# Altium project PROC054D_MMW_CAS_RF_EVM.PrjPcb (part 7 of 9)

## Sheet PROC054D_AWR_1_AWR_4_LC_Filtering.SchDoc: AWR_1_AWR_4_LC_Filtering
size 558 x 431 mm; Date: Not shown in title block; ApprovedBy: Not shown in title block; CheckedBy: Not shown in title block; Author: Not shown in title block; CompanyName: Not shown in title block; DrawnBy: a0271760; Engineer: Not shown in title block; Organization: Not shown in title block; Address1: Not shown in title block; Address2: Not shown in title block; Address3: Not shown in title block; Address4: Not shown in title block; DocumentNumber: 6; Revision: Use project pAWRameter SCH_Rev; SheetNumber: 6; SheetTotal: 19; PageSetup: Record=PageOptions|CenterHorizontal=True|CenterVertical=True|PrintScale=1.00|XCorrection=1.00|YCorrection=1.00|PrintKind=0|BorderSize=5000000|LeftOffset=0|BottomOffset=0|Orientation=2|PaperLength=1000|PaperWidth=1000|Scale=100|PaperSource=15|PrintQuality=600|MediaType=1|DitherType=10|PaperKind=Letter|PrintScaleMode=1; CurrentTime: Not shown in title block; CurrentDate: Not shown in title block; Time: Not shown in title block; DocumentFullPathAndName: Not shown in title block; DocumentName: Not shown in title block; ModifiedDate: Not shown in title block; ImagePath: Not shown in title block
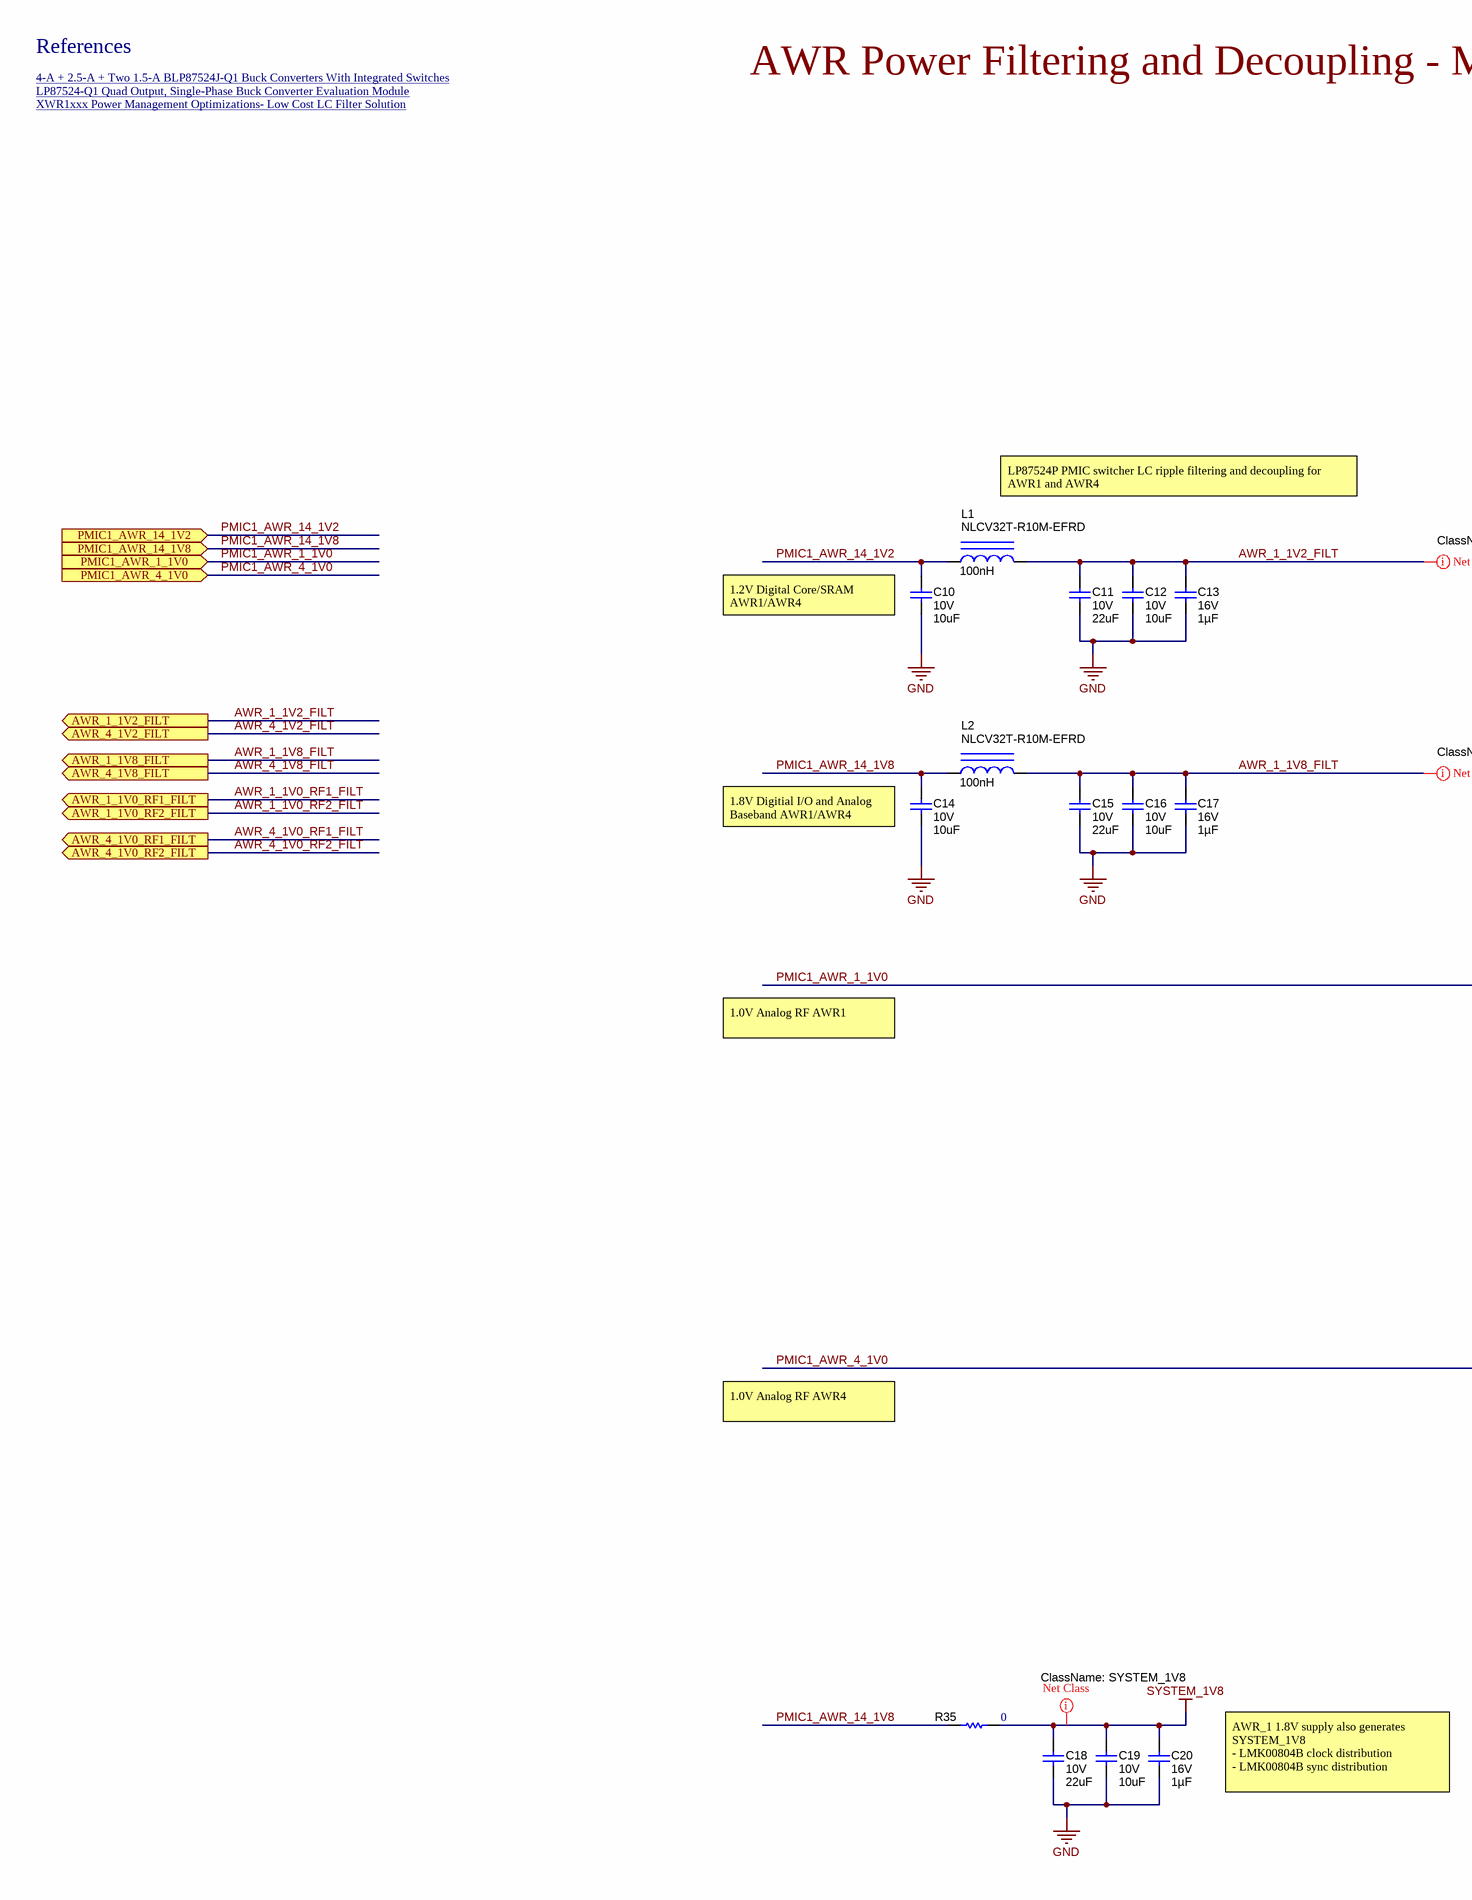
[diagram p32: PROC054D_AWR_1_AWR_4_LC_Filtering.SchDoc, left]
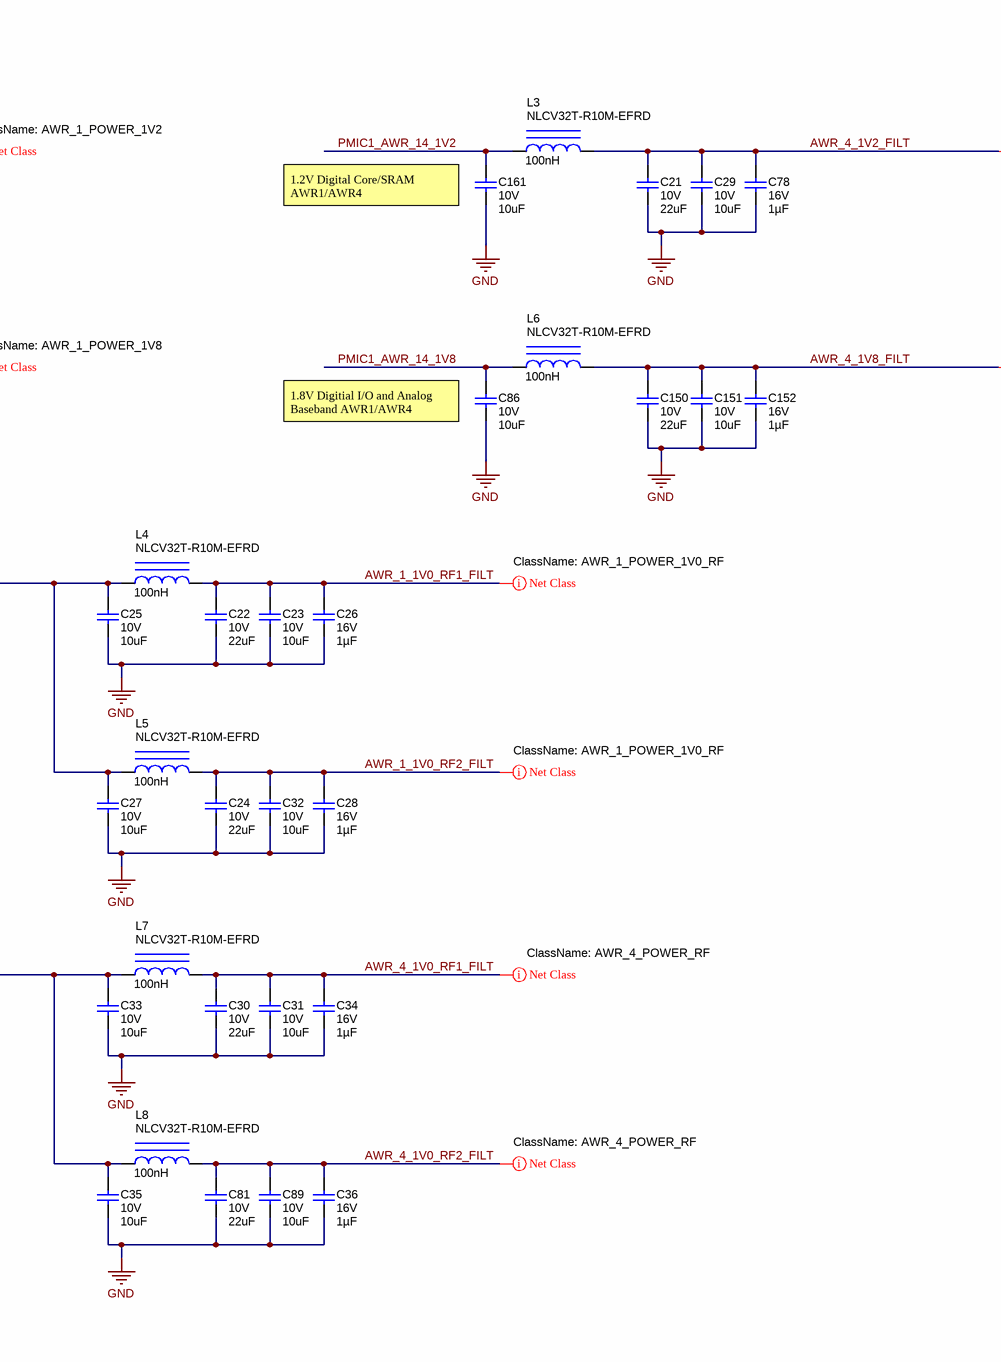
[diagram p33: PROC054D_AWR_1_AWR_4_LC_Filtering.SchDoc, right]

### Parts
C10  VDC_V: 10V  ValueDisplayed: 10uF  [0805L]  (hidden comment: GCM21BR71A106KE22L)
C11  VDC_V: 10V  ValueDisplayed: 22uF  [1206_180L]  (hidden comment: GCM31CR71A226KE02)
C12  VDC_V: 10V  ValueDisplayed: 10uF  [0805L]  (hidden comment: GCM21BR71A106KE22L)
C13  VDC_V: 16V  ValueDisplayed: 1µF  [0603S]  (hidden comment: GCM188R71C105KA64J)
C14  VDC_V: 10V  ValueDisplayed: 10uF  [0805L]  (hidden comment: GCM21BR71A106KE22L)
C15  VDC_V: 10V  ValueDisplayed: 22uF  [1206_180L]  (hidden comment: GCM31CR71A226KE02)
C16  VDC_V: 10V  ValueDisplayed: 10uF  [0805L]  (hidden comment: GCM21BR71A106KE22L)
C17  VDC_V: 16V  ValueDisplayed: 1µF  [0603S]  (hidden comment: GCM188R71C105KA64J)
C18  VDC_V: 10V  ValueDisplayed: 22uF  [1206_180L]  (hidden comment: GCM31CR71A226KE02)
C19  VDC_V: 10V  ValueDisplayed: 10uF  [0805L]  (hidden comment: GCM21BR71A106KE22L)
C20  VDC_V: 16V  ValueDisplayed: 1µF  [0603S]  (hidden comment: GCM188R71C105KA64J)
C21  VDC_V: 10V  ValueDisplayed: 22uF  [1206_180L]  (hidden comment: GCM31CR71A226KE02)
C22  VDC_V: 10V  ValueDisplayed: 22uF  [1206_180L]  (hidden comment: GCM31CR71A226KE02)
C23  VDC_V: 10V  ValueDisplayed: 10uF  [0805L]  (hidden comment: GCM21BR71A106KE22L)
C24  VDC_V: 10V  ValueDisplayed: 22uF  [1206_180L]  (hidden comment: GCM31CR71A226KE02)
C25  VDC_V: 10V  ValueDisplayed: 10uF  [0805L]  (hidden comment: GCM21BR71A106KE22L)
C26  VDC_V: 16V  ValueDisplayed: 1µF  [0603S]  (hidden comment: GCM188R71C105KA64J)
C27  VDC_V: 10V  ValueDisplayed: 10uF  [0805L]  (hidden comment: GCM21BR71A106KE22L)
C28  VDC_V: 16V  ValueDisplayed: 1µF  [0603S]  (hidden comment: GCM188R71C105KA64J)
C29  VDC_V: 10V  ValueDisplayed: 10uF  [0805L]  (hidden comment: GCM21BR71A106KE22L)
C30  VDC_V: 10V  ValueDisplayed: 22uF  [1206_180L]  (hidden comment: GCM31CR71A226KE02)
C31  VDC_V: 10V  ValueDisplayed: 10uF  [0805L]  (hidden comment: GCM21BR71A106KE22L)
C32  VDC_V: 10V  ValueDisplayed: 10uF  [0805L]  (hidden comment: GCM21BR71A106KE22L)
C33  VDC_V: 10V  ValueDisplayed: 10uF  [0805L]  (hidden comment: GCM21BR71A106KE22L)
C34  VDC_V: 16V  ValueDisplayed: 1µF  [0603S]  (hidden comment: GCM188R71C105KA64J)
C35  VDC_V: 10V  ValueDisplayed: 10uF  [0805L]  (hidden comment: GCM21BR71A106KE22L)
C36  VDC_V: 16V  ValueDisplayed: 1µF  [0603S]  (hidden comment: GCM188R71C105KA64J)
C78  VDC_V: 16V  ValueDisplayed: 1µF  [0603S]  (hidden comment: GCM188R71C105KA64J)
C81  VDC_V: 10V  ValueDisplayed: 22uF  [1206_180L]  (hidden comment: GCM31CR71A226KE02)
C86  VDC_V: 10V  ValueDisplayed: 10uF  [0805L]  (hidden comment: GCM21BR71A106KE22L)
C89  VDC_V: 10V  ValueDisplayed: 10uF  [0805L]  (hidden comment: GCM21BR71A106KE22L)
C150  VDC_V: 10V  ValueDisplayed: 22uF  [1206_180L]  (hidden comment: GCM31CR71A226KE02)
C151  VDC_V: 10V  ValueDisplayed: 10uF  [0805L]  (hidden comment: GCM21BR71A106KE22L)
C152  VDC_V: 16V  ValueDisplayed: 1µF  [0603S]  (hidden comment: GCM188R71C105KA64J)
C161  VDC_V: 10V  ValueDisplayed: 10uF  [0805L]  (hidden comment: GCM21BR71A106KE22L)
L1  ValueDisplayed: 100nH  [NLCV32]  (hidden comment: NLCV32T-R10M-EFRD)
L2  ValueDisplayed: 100nH  [NLCV32]  (hidden comment: NLCV32T-R10M-EFRD)
L3  ValueDisplayed: 100nH  [NLCV32]  (hidden comment: NLCV32T-R10M-EFRD)
L4  ValueDisplayed: 100nH  [NLCV32]  (hidden comment: NLCV32T-R10M-EFRD)
L5  ValueDisplayed: 100nH  [NLCV32]  (hidden comment: NLCV32T-R10M-EFRD)
L6  ValueDisplayed: 100nH  [NLCV32]  (hidden comment: NLCV32T-R10M-EFRD)
L7  ValueDisplayed: 100nH  [NLCV32]  (hidden comment: NLCV32T-R10M-EFRD)
L8  ValueDisplayed: 100nH  [NLCV32]  (hidden comment: NLCV32T-R10M-EFRD)
R35  ValueDisplayed: 0  [0805_HV]  (hidden comment: PMR10EZPJ000)

### Ports
AWR_1_1V0_RF1_FILT (out), AWR_1_1V0_RF2_FILT (out), AWR_1_1V2_FILT (out), AWR_1_1V8_FILT (out), AWR_4_1V0_RF1_FILT (out), AWR_4_1V0_RF2_FILT (out), AWR_4_1V2_FILT (out), AWR_4_1V8_FILT (out), PMIC1_AWR_1_1V0 (in), PMIC1_AWR_4_1V0 (in), PMIC1_AWR_14_1V2 (in), PMIC1_AWR_14_1V8 (in)

### Nets
GND: C10.2 C11.2 C12.2 C13.2 C14.2 C15.2 C16.2 C17.2 C18.2 C19.2 C20.2 C21.2 C22.2 C23.2 C24.2 C25.2 C26.2 C27.2 C28.2 C29.2 C30.2 C31.2 C32.2 C33.2 C34.2 C35.2 C36.2 C78.2 C81.2 C86.2 C89.2 C150.2 C151.2 C152.2 C161.2
SYSTEM_1V8: C18.1 C19.1 C20.1 R35.2
AWR_1_1V0_RF1_FILT: C22.1 C23.1 C26.1 L4.2 ; port AWR_1_1V0_RF1_FILT
AWR_1_1V0_RF2_FILT: C24.1 C28.1 C32.1 L5.2 ; port AWR_1_1V0_RF2_FILT
AWR_1_1V2_FILT: C11.1 C12.1 C13.1 L1.2 ; port AWR_1_1V2_FILT
AWR_1_1V8_FILT: C15.1 C16.1 C17.1 L2.2 ; port AWR_1_1V8_FILT
AWR_4_1V0_RF1_FILT: C30.1 C31.1 C34.1 L7.2 ; port AWR_4_1V0_RF1_FILT
AWR_4_1V0_RF2_FILT: C36.1 C81.1 C89.1 L8.2 ; port AWR_4_1V0_RF2_FILT
AWR_4_1V2_FILT: C21.1 C29.1 C78.1 L3.2 ; port AWR_4_1V2_FILT
AWR_4_1V8_FILT: C150.1 C151.1 C152.1 L6.2 ; port AWR_4_1V8_FILT
PMIC1_AWR_1_1V0: C25.1 C27.1 L4.1 L5.1 ; port PMIC1_AWR_1_1V0
PMIC1_AWR_4_1V0: C33.1 C35.1 L7.1 L8.1 ; port PMIC1_AWR_4_1V0
PMIC1_AWR_14_1V2: C10.1 C161.1 L1.1 L3.1 ; port PMIC1_AWR_14_1V2
PMIC1_AWR_14_1V8: C14.1 C86.1 L2.1 L6.1 R35.1 ; port PMIC1_AWR_14_1V8

### Layout directives
net class AWR_1_POWER_1V2: AWR_1_1V2_FILT
net class AWR_1_POWER_1V0_RF: AWR_1_1V0_RF1_FILT, AWR_1_1V0_RF2_FILT
net class AWR_4_POWER_RF: AWR_4_1V0_RF1_FILT, AWR_4_1V0_RF2_FILT
net class SYSTEM_1V8: SYSTEM_1V8
net class AWR_1_POWER_1V8: AWR_1_1V8_FILT
net class AWR_4_POWER_1V2: AWR_4_1V2_FILT
net class AWR_4_POWER_1V8: AWR_4_1V8_FILT

### Notes on the sheet
- References
- LP87524-Q1 Quad Output, Single-Phase Buck Converter Evaluation Module <http://www.ti.com/tool/lp87524q1evm>
- XWR1xxx Power Management Optimizations- Low Cost LC Filter Solution <http://www.ti.com/lit/pdf/swra577>
- 4-A + 2.5-A + Two 1.5-A BLP87524J-Q1 Buck Converters With Integrated Switches <http://www.ti.com/product/lp87524j-q1>
- AWR Power Filtering and Decoupling - Master AWR_1 and Slave AWR_4
- LP87524P PMIC switcher LC ripple filtering and decoupling for AWR1 and AWR4
- (near C10) 1.2V Digital Core/SRAM AWR1/AWR4
- (near C161) 1.2V Digital Core/SRAM AWR1/AWR4
- (near C14) 1.8V Digitial I/O and Analog Baseband AWR1/AWR4
- (near C86) 1.8V Digitial I/O and Analog Baseband AWR1/AWR4
- 1.0V Analog RF AWR1
- 1.0V Analog RF AWR4
- AWR_1 1.8V supply also generates SYSTEM_1V8
  - LMK00804B clock distribution
  - LMK00804B sync distribution
- Drawn By:
- SVN Rev:
- Number:
- TID #:
- Orderable:
- Rev:
- Sheet Title:
- File:
- Project Title:
- Designed for:
- Assembly VAWRiant:
- Mod. Date:
- Sheet:
- Size:
- of
- C
- http://www.ti.com
- Texas Instruments and/or its licensors do not wAWRrant the accuracy or completeness of this specification or any information contained therein. Texas Instruments and/or its licensors do not wAWRrant that this design will meet the specifications, will be suitable for your application or fit for any pAWRticulAWR purpose, or will operate in an implementation. Texas Instruments and/or its licensors do not wAWRrant that the design is production worthy. You should completely validate and test your design implementation to confirm the system functionality for your application.
- Engineer:
- Contact:
- © Texas Instruments

### Library data of the parts
C10 C12 C14 C16 C23 C25 C27 C29 C31-C33 C35 C86 C89 C151 C161 = CMP-0008017-2: CAP, CERM, 10 uF, 10 V, +/- 10%, X7R, 0805; Manufacturer: MuRata; TaMin_C: -55°C; Polarized: N; SizeAreaWB_mm2: 6.75; Value1: Unknown; U/M: EA; Value: 10uF; TaMax_C: 125°C; SizeZ_mm: 1.45; SizeX_mm: 2; SizeY_mm: 1.25; Cap_Case: 0805; SizeArea_mm2: 2.5; Cap_F: 10µF; AEC Category: Q200; Supplier Part Number 2: 06AC6014; Publisher: Texas Instruments; Supplier 2: Newark; Supplier Part Number 3: 81-GCM21BR71A106KE2L; TempCo: X7R; Supplier 3: Mouser; Published: 2008-06-19; RoHS: Y; MountType: SMT; Supplier 1: Digi-Key; PackageReference: 0805; Tolerance_%: 10%; Value2: 10V; CompType: Capacitor; LatestRevisionDate: 2017-03-09; PartNumber: GCM21BR71A106KE22L; AEC Qualified: ?; ComponentLink1Description: Datasheet link; Supplier Part Number 1: 490-10674-1-ND; Technology: Ceramic; ComponentLink1URL: http://www.murata.com/products/catalog/pdf/c03e.pdf
C11 C18 = CMP-0008811-2: CAP, CERM, 22 uF, 10 V, +/- 10%, X7R, AEC-Q200 Grade 1, 1206; Manufacturer: MuRata; TaMin_C: -55°C; Polarized: N; SizeAreaWB_mm2: 10.92; Value1: Unknown; U/M: EA; Value: 22uF; TaMax_C: 125°C; SizeZ_mm: 1.8; SizeX_mm: 3.2; SizeY_mm: 1.6; Cap_Case: 1206; SizeArea_mm2: 5.12; CompType: Capacitor; AEC Qualified: Y; Cap_F: 22µF; AEC Grade: 1; AEC Category: Q200; Publisher: Texas Instruments; TempCo: X7R; Published: 2008-06-19; RoHS: Y; MountType: SMT; PackageReference: 1206; Tolerance_%: 10%; Value2: 10V; LatestRevisionDate: 2017-03-09; PartNumber: GCM31CR71A226KE02; ComponentLink1Description: Datasheet link; Technology: Ceramic; ComponentLink1URL: http://psearch.en.murata.com/capacitor/product/GCM31CR71A226KE02%23.pdf
C13 C17 C26 C28 C34 C36 C78 C152 = CMP-0079154-1: CAP, CERM, 1 µF, 16 V,+/- 10%, X7R, AEC-Q200 Grade 1, 0603; Manufacturer: MuRata; SizeAreaWB_mm2: 4.68; SizeArea_mm2: 1.28; AEC Qualified: Y; AEC Category: Q200; Value: 1uF; TaMax_C: 125°C; SizeZ_mm: 1; Polarized: N; TaMin_C: -55°C; SizeY_mm: 0.8; U/M: EA; SizeX_mm: 1.6; Cap_Case: 0603; ComponentLink1Description: Datasheet link; Cap_F: 1µF; RoHS: Y; Tolerance_%: 10%; Supplier 1: Digi-Key; PackageReference: 0603; Technology: Ceramic; PartNumber: GCM188R71C105KA64J; TempCo: X7R; Supplier Part Number 2: 81-GCM188R71C105KA4J; Supplier 2: Mouser; AEC Grade: 1; Value2: 16V; ComponentLink1URL: https://www.murata.com/~/media/webrenewal/support/library/catalog/products/capacitor/mlcc/c03e.ashx; CompType: Capacitor; MountType: SMT; Supplier Part Number 1: 490-12657-1-ND
C15 C21 C22 C24 C30 C81 C150 = CMP-0008811-2: CAP, CERM, 22 uF, 10 V, +/- 10%, X7R, AEC-Q200 Grade 1, 1206; Manufacturer: MuRata; TaMin_C: -55°C; Polarized: N; SizeAreaWB_mm2: 10.92; Value1: Unknown; U/M: EA; Value: 22uF; TaMax_C: 125°C; SizeZ_mm: 1.8; SizeX_mm: 3.2; SizeY_mm: 1.6; Cap_Case: 1206; SizeArea_mm2: 5.12; AEC Qualified: Y; Cap_F: 22µF; AEC Grade: 1; AEC Category: Q200; Publisher: Texas Instruments; TempCo: X7R; Published: 2008-06-19; RoHS: Y; MountType: SMT; PackageReference: 1206; Tolerance_%: 10%; Value2: 10V; CompType: Capacitor; LatestRevisionDate: 2017-03-09; PartNumber: GCM31CR71A226KE02; ComponentLink1Description: Datasheet link; Technology: Ceramic; ComponentLink1URL: http://psearch.en.murata.com/capacitor/product/GCM31CR71A226KE02%23.pdf
C19 = CMP-0008017-2: CAP, CERM, 10 uF, 10 V, +/- 10%, X7R, 0805; Manufacturer: MuRata; TaMin_C: -55°C; Polarized: N; SizeAreaWB_mm2: 6.75; Value1: Unknown; U/M: EA; Value: 10uF; TaMax_C: 125°C; SizeZ_mm: 1.45; SizeX_mm: 2; SizeY_mm: 1.25; Cap_Case: 0805; SizeArea_mm2: 2.5; CompType: Capacitor; Cap_F: 10µF; AEC Category: Q200; Supplier Part Number 2: 06AC6014; Publisher: Texas Instruments; Supplier 2: Newark; Supplier Part Number 3: 81-GCM21BR71A106KE2L; TempCo: X7R; Supplier 3: Mouser; Published: 2008-06-19; RoHS: Y; MountType: SMT; Supplier 1: Digi-Key; PackageReference: 0805; Tolerance_%: 10%; Value2: 10V; LatestRevisionDate: 2017-03-09; PartNumber: GCM21BR71A106KE22L; AEC Qualified: ?; ComponentLink1Description: Datasheet link; Supplier Part Number 1: 490-10674-1-ND; Technology: Ceramic; ComponentLink1URL: http://www.murata.com/products/catalog/pdf/c03e.pdf
C20 = CMP-0079154-1: CAP, CERM, 1 µF, 16 V,+/- 10%, X7R, AEC-Q200 Grade 1, 0603; Manufacturer: MuRata; SizeAreaWB_mm2: 4.68; SizeArea_mm2: 1.28; AEC Qualified: Y; AEC Category: Q200; Value: 1uF; TaMax_C: 125°C; SizeZ_mm: 1; Polarized: N; TaMin_C: -55°C; SizeY_mm: 0.8; U/M: EA; CompType: Capacitor; SizeX_mm: 1.6; Cap_Case: 0603; ComponentLink1Description: Datasheet link; Cap_F: 1µF; RoHS: Y; Tolerance_%: 10%; Supplier 1: Digi-Key; PackageReference: 0603; Technology: Ceramic; PartNumber: GCM188R71C105KA64J; TempCo: X7R; Supplier Part Number 2: 81-GCM188R71C105KA4J; Supplier 2: Mouser; AEC Grade: 1; Value2: 16V; ComponentLink1URL: https://www.murata.com/~/media/webrenewal/support/library/catalog/products/capacitor/mlcc/c03e.ashx; MountType: SMT; Supplier Part Number 1: 490-12657-1-ND
L1-L8 = CMP-0083745-1: Inductor, Wirewound, Ferrite, 100 nH, 2.85 A, 0.024 ohm, AEC-Q200 Grade 1, SMD; Manufacturer: TDK; Isat: 2.85A @ 10% inductance drop; Irms: 2.85A @ 40C rise; SizeAreaWB_mm2: 13.44; DCR_ohm: 0.024; Value: 100nH; Imax_A: 2.85A; SizeZ_mm: 2.5; SizeX_mm: 3.2; SizeY_mm: 2.2; SizeArea_mm2: 7.04; AEC Qualified: Y; AEC Grade: 1; AEC Category: Q200; ComponentLink1URL: https://product.tdk.com/info/en/catalog/datasheets/inductor_automotive_decoupling_nlcv32-efrd_en.pdf; RoHS: Y; Value1: 0.024 ohm; Material: Ferrite; MountType: SMT; PackageReference: 3.2x2.2x2.5mm; Value2: 2.85A; CompType: Inductor; Ind_H: 100nH; PartNumber: NLCV32T-R10M-EFRD; ComponentLink1Description: Datasheet link; Technology: Wirewound
R35 = CMP-0081857-1: RES, 0, 0%,  W, AEC-Q200 Grade 0, 0805; Manufacturer: Rohm; SizeAreaWB_mm2: 6.75; SizeArea_mm2: 2.5; AEC Qualified: Y; AEC Category: Q200; Value: 0; SizeZ_mm: 1.45; SizeY_mm: 1.25; SizeX_mm: 2; ComponentLink1Description: Datasheet link; RoHS: Y; Tolerance_%: 0%; Value_Code: 0; Supplier 1: Mouser; PackageReference: 0805; Technology: Thick Film; Res_ohm: 0; PartNumber: PMR10EZPJ000; AEC Grade: 0; Value2: W; ComponentLink1URL: http://www.rohm.com/web/global/datasheet/PMR10EZPJ000/pmr-jpw-e; Value1: 0%; CompType: Resistor; MountType: SMT; Supplier Part Number 1: 755-PMR10EZPJ000

## Sheet PROC054D_AWR_2_AWR_3_LC_Filtering.SchDoc: AWR_2_AWR_3_LC_Filtering
size 558 x 431 mm; Date: Not shown in title block; ApprovedBy: Not shown in title block; CheckedBy: Not shown in title block; Author: Not shown in title block; CompanyName: Not shown in title block; DrawnBy: a0271760; Engineer: Not shown in title block; Organization: Not shown in title block; Address1: Not shown in title block; Address2: Not shown in title block; Address3: Not shown in title block; Address4: Not shown in title block; DocumentNumber: 7; Revision: Use project pAWRameter SCH_Rev; SheetNumber: 7; SheetTotal: 19; PageSetup: Record=PageOptions|CenterHorizontal=True|CenterVertical=True|PrintScale=1.00|XCorrection=1.00|YCorrection=1.00|PrintKind=0|BorderSize=5000000|LeftOffset=0|BottomOffset=0|Orientation=2|PaperLength=1000|PaperWidth=1000|Scale=100|PaperSource=15|PrintQuality=600|MediaType=1|DitherType=10|PaperKind=Letter|PrintScaleMode=1; CurrentTime: Not shown in title block; CurrentDate: Not shown in title block; Time: Not shown in title block; DocumentFullPathAndName: Not shown in title block; DocumentName: Not shown in title block; ModifiedDate: Not shown in title block; ImagePath: Not shown in title block
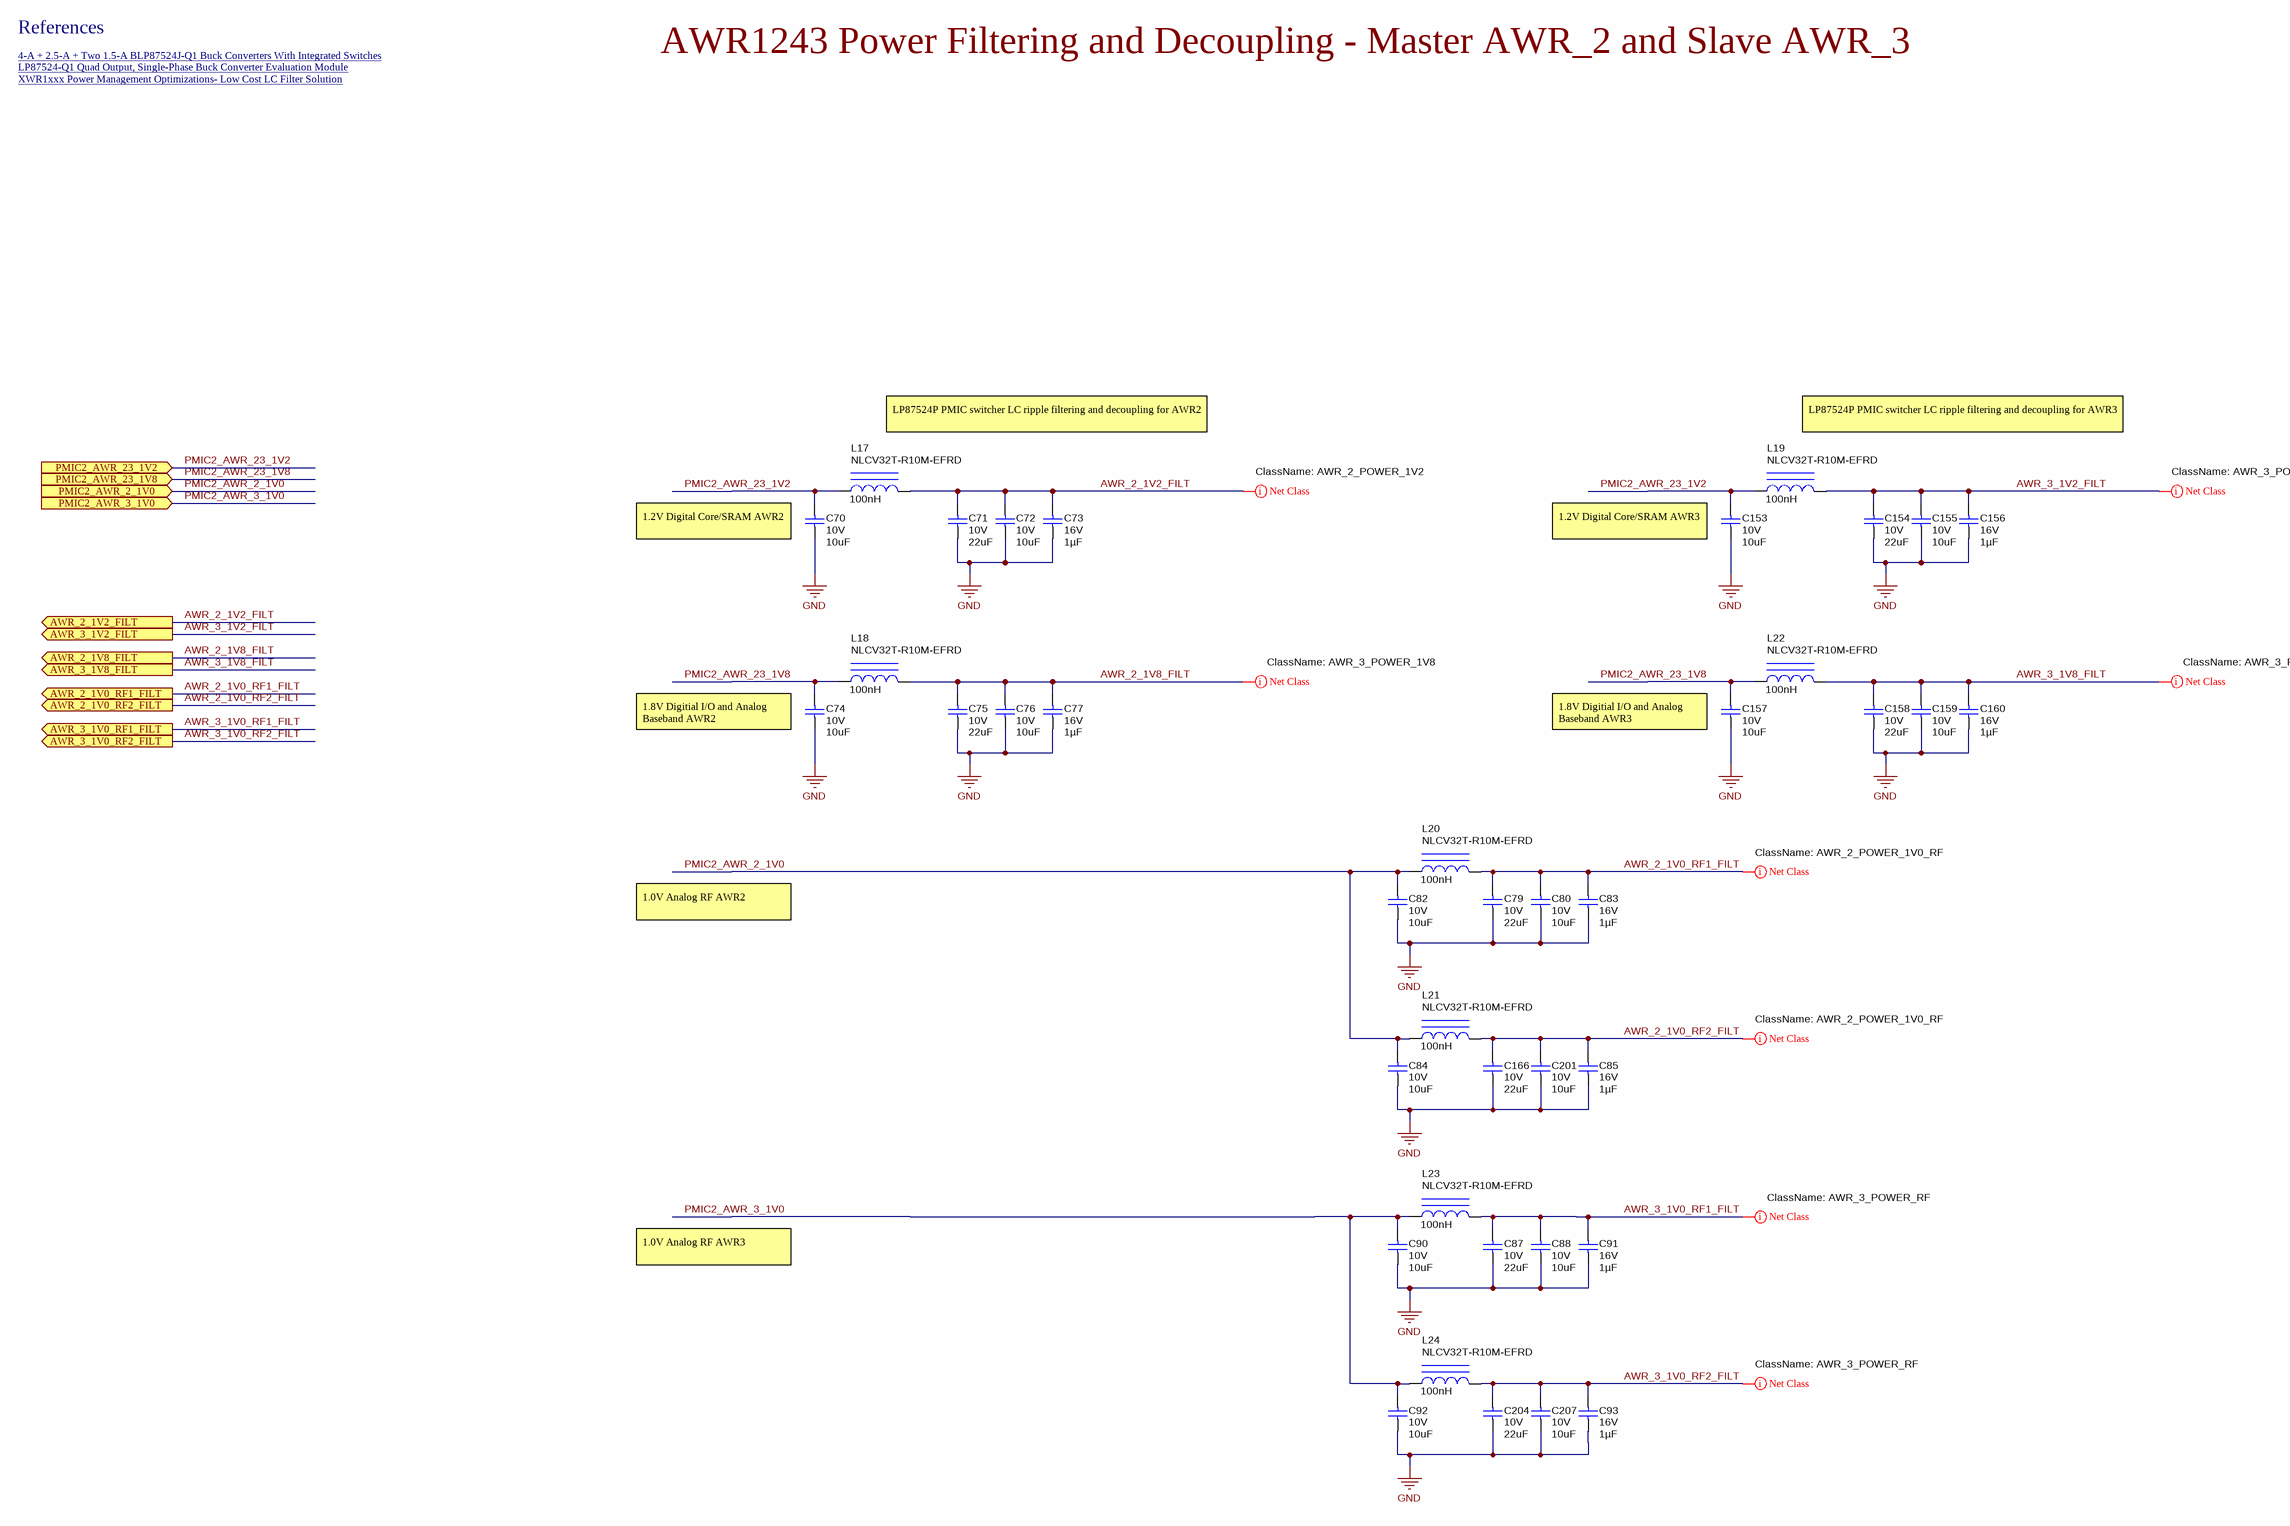
[diagram p34: PROC054D_AWR_2_AWR_3_LC_Filtering.SchDoc]

### Parts
C70  VDC_V: 10V  ValueDisplayed: 10uF  [0805L]  (hidden comment: GCM21BR71A106KE22L)
C71  VDC_V: 10V  ValueDisplayed: 22uF  [1206_180L]  (hidden comment: GCM31CR71A226KE02)
C72  VDC_V: 10V  ValueDisplayed: 10uF  [0805L]  (hidden comment: GCM21BR71A106KE22L)
C73  VDC_V: 16V  ValueDisplayed: 1µF  [0603S]  (hidden comment: GCM188R71C105KA64J)
C74  VDC_V: 10V  ValueDisplayed: 10uF  [0805L]  (hidden comment: GCM21BR71A106KE22L)
C75  VDC_V: 10V  ValueDisplayed: 22uF  [1206_180L]  (hidden comment: GCM31CR71A226KE02)
C76  VDC_V: 10V  ValueDisplayed: 10uF  [0805L]  (hidden comment: GCM21BR71A106KE22L)
C77  VDC_V: 16V  ValueDisplayed: 1µF  [0603S]  (hidden comment: GCM188R71C105KA64J)
C79  VDC_V: 10V  ValueDisplayed: 22uF  [1206_180L]  (hidden comment: GCM31CR71A226KE02)
C80  VDC_V: 10V  ValueDisplayed: 10uF  [0805L]  (hidden comment: GCM21BR71A106KE22L)
C82  VDC_V: 10V  ValueDisplayed: 10uF  [0805L]  (hidden comment: GCM21BR71A106KE22L)
C83  VDC_V: 16V  ValueDisplayed: 1µF  [0603S]  (hidden comment: GCM188R71C105KA64J)
C84  VDC_V: 10V  ValueDisplayed: 10uF  [0805L]  (hidden comment: GCM21BR71A106KE22L)
C85  VDC_V: 16V  ValueDisplayed: 1µF  [0603S]  (hidden comment: GCM188R71C105KA64J)
C87  VDC_V: 10V  ValueDisplayed: 22uF  [1206_180L]  (hidden comment: GCM31CR71A226KE02)
C88  VDC_V: 10V  ValueDisplayed: 10uF  [0805L]  (hidden comment: GCM21BR71A106KE22L)
C90  VDC_V: 10V  ValueDisplayed: 10uF  [0805L]  (hidden comment: GCM21BR71A106KE22L)
C91  VDC_V: 16V  ValueDisplayed: 1µF  [0603S]  (hidden comment: GCM188R71C105KA64J)
C92  VDC_V: 10V  ValueDisplayed: 10uF  [0805L]  (hidden comment: GCM21BR71A106KE22L)
C93  VDC_V: 16V  ValueDisplayed: 1µF  [0603S]  (hidden comment: GCM188R71C105KA64J)
C153  VDC_V: 10V  ValueDisplayed: 10uF  [0805L]  (hidden comment: GCM21BR71A106KE22L)
C154  VDC_V: 10V  ValueDisplayed: 22uF  [1206_180L]  (hidden comment: GCM31CR71A226KE02)
C155  VDC_V: 10V  ValueDisplayed: 10uF  [0805L]  (hidden comment: GCM21BR71A106KE22L)
C156  VDC_V: 16V  ValueDisplayed: 1µF  [0603S]  (hidden comment: GCM188R71C105KA64J)
C157  VDC_V: 10V  ValueDisplayed: 10uF  [0805L]  (hidden comment: GCM21BR71A106KE22L)
C158  VDC_V: 10V  ValueDisplayed: 22uF  [1206_180L]  (hidden comment: GCM31CR71A226KE02)
C159  VDC_V: 10V  ValueDisplayed: 10uF  [0805L]  (hidden comment: GCM21BR71A106KE22L)
C160  VDC_V: 16V  ValueDisplayed: 1µF  [0603S]  (hidden comment: GCM188R71C105KA64J)
C166  VDC_V: 10V  ValueDisplayed: 22uF  [1206_180L]  (hidden comment: GCM31CR71A226KE02)
C201  VDC_V: 10V  ValueDisplayed: 10uF  [0805L]  (hidden comment: GCM21BR71A106KE22L)
C204  VDC_V: 10V  ValueDisplayed: 22uF  [1206_180L]  (hidden comment: GCM31CR71A226KE02)
C207  VDC_V: 10V  ValueDisplayed: 10uF  [0805L]  (hidden comment: GCM21BR71A106KE22L)
L17  ValueDisplayed: 100nH  [NLCV32]  (hidden comment: NLCV32T-R10M-EFRD)
L18  ValueDisplayed: 100nH  [NLCV32]  (hidden comment: NLCV32T-R10M-EFRD)
L19  ValueDisplayed: 100nH  [NLCV32]  (hidden comment: NLCV32T-R10M-EFRD)
L20  ValueDisplayed: 100nH  [NLCV32]  (hidden comment: NLCV32T-R10M-EFRD)
L21  ValueDisplayed: 100nH  [NLCV32]  (hidden comment: NLCV32T-R10M-EFRD)
L22  ValueDisplayed: 100nH  [NLCV32]  (hidden comment: NLCV32T-R10M-EFRD)
L23  ValueDisplayed: 100nH  [NLCV32]  (hidden comment: NLCV32T-R10M-EFRD)
L24  ValueDisplayed: 100nH  [NLCV32]  (hidden comment: NLCV32T-R10M-EFRD)

### Ports
AWR_2_1V0_RF1_FILT (out), AWR_2_1V0_RF2_FILT (out), AWR_2_1V2_FILT (out), AWR_2_1V8_FILT (out), AWR_3_1V0_RF1_FILT (out), AWR_3_1V0_RF2_FILT (out), AWR_3_1V2_FILT (out), AWR_3_1V8_FILT (out), PMIC2_AWR_2_1V0 (in), PMIC2_AWR_3_1V0 (in), PMIC2_AWR_23_1V2 (in), PMIC2_AWR_23_1V8 (in)

### Nets
GND: C70.2 C71.2 C72.2 C73.2 C74.2 C75.2 C76.2 C77.2 C79.2 C80.2 C82.2 C83.2 C84.2 C85.2 C87.2 C88.2 C90.2 C91.2 C92.2 C93.2 C153.2 C154.2 C155.2 C156.2 C157.2 C158.2 C159.2 C160.2 C166.2 C201.2 C204.2 C207.2
AWR_2_1V0_RF1_FILT: C79.1 C80.1 C83.1 L20.2 ; port AWR_2_1V0_RF1_FILT
AWR_2_1V0_RF2_FILT: C85.1 C166.1 C201.1 L21.2 ; port AWR_2_1V0_RF2_FILT
AWR_2_1V2_FILT: C71.1 C72.1 C73.1 L17.2 ; port AWR_2_1V2_FILT
AWR_2_1V8_FILT: C75.1 C76.1 C77.1 L18.2 ; port AWR_2_1V8_FILT
AWR_3_1V0_RF1_FILT: C87.1 C88.1 C91.1 L23.2 ; port AWR_3_1V0_RF1_FILT
AWR_3_1V0_RF2_FILT: C93.1 C204.1 C207.1 L24.2 ; port AWR_3_1V0_RF2_FILT
AWR_3_1V2_FILT: C154.1 C155.1 C156.1 L19.2 ; port AWR_3_1V2_FILT
AWR_3_1V8_FILT: C158.1 C159.1 C160.1 L22.2 ; port AWR_3_1V8_FILT
PMIC2_AWR_2_1V0: C82.1 C84.1 L20.1 L21.1 ; port PMIC2_AWR_2_1V0
PMIC2_AWR_3_1V0: C90.1 C92.1 L23.1 L24.1 ; port PMIC2_AWR_3_1V0
PMIC2_AWR_23_1V2: C70.1 C153.1 L17.1 L19.1 ; port PMIC2_AWR_23_1V2
PMIC2_AWR_23_1V8: C74.1 C157.1 L18.1 L22.1 ; port PMIC2_AWR_23_1V8

### Layout directives
net class AWR_2_POWER_1V2: AWR_2_1V2_FILT
net class AWR_2_POWER_1V0_RF: AWR_2_1V0_RF1_FILT, AWR_2_1V0_RF2_FILT
net class AWR_3_POWER_RF: AWR_3_1V0_RF1_FILT, AWR_3_1V0_RF2_FILT
net class AWR_3_POWER_1V8: AWR_2_1V8_FILT, AWR_3_1V8_FILT
net class AWR_3_POWER_1V2: AWR_3_1V2_FILT

### Notes on the sheet
- References
- 4-A + 2.5-A + Two 1.5-A BLP87524J-Q1 Buck Converters With Integrated Switches <http://www.ti.com/product/lp87524j-q1>
- LP87524-Q1 Quad Output, Single-Phase Buck Converter Evaluation Module <http://www.ti.com/tool/lp87524q1evm>
- XWR1xxx Power Management Optimizations- Low Cost LC Filter Solution <http://www.ti.com/lit/pdf/swra577>
- AWR1243 Power Filtering and Decoupling - Master AWR_2 and Slave AWR_3
- LP87524P PMIC switcher LC ripple filtering and decoupling for AWR2
- LP87524P PMIC switcher LC ripple filtering and decoupling for AWR3
- (near C70) 1.2V Digital Core/SRAM AWR2
- (near C153) 1.2V Digital Core/SRAM AWR3
- (near C74) 1.8V Digitial I/O and Analog Baseband AWR2
- (near C157) 1.8V Digitial I/O and Analog Baseband AWR3
- 1.0V Analog RF AWR2
- 1.0V Analog RF AWR3
- Drawn By:
- SVN Rev:
- Number:
- TID #:
- Orderable:
- Rev:
- Sheet Title:
- File:
- Project Title:
- Designed for:
- Assembly VAWRiant:
- Mod. Date:
- Sheet:
- Size:
- of
- C
- http://www.ti.com
- Texas Instruments and/or its licensors do not wAWRrant the accuracy or completeness of this specification or any information contained therein. Texas Instruments and/or its licensors do not wAWRrant that this design will meet the specifications, will be suitable for your application or fit for any pAWRticulAWR purpose, or will operate in an implementation. Texas Instruments and/or its licensors do not wAWRrant that the design is production worthy. You should completely validate and test your design implementation to confirm the system functionality for your application.
- Engineer:
- Contact:
- © Texas Instruments

### Library data of the parts
C70 C72 C74 C76 C80 C82 C84 C88 C90 C92 C153 C155 C157 C159 C201 C207 = CMP-0008017-2: as C10 on sheet PROC054D_AWR_1_AWR_4_LC_Filtering; Supplier Part Number 2: 06AC6014; Publisher: Texas Instruments; Supplier 2: Newark; Supplier Part Number 3: 81-GCM21BR71A106KE2L; TempCo: X7R; Supplier 3: Mouser; Published: 2008-06-19; RoHS: Y; MountType: SMT; Supplier 1: Digi-Key; PackageReference: 0805; Tolerance_%: 10%; Value2: 10V; CompType: Capacitor; LatestRevisionDate: 2017-03-09; PartNumber: GCM21BR71A106KE22L; AEC Qualified: ?; ComponentLink1Description: Datasheet link; Supplier Part Number 1: 490-10674-1-ND; Technology: Ceramic; ComponentLink1URL: http://www.murata.com/products/catalog/pdf/c03e.pdf
C71 C75 C79 C87 C154 C158 C166 C204 = CMP-0008811-2: as C15 on sheet PROC054D_AWR_1_AWR_4_LC_Filtering; Publisher: Texas Instruments; TempCo: X7R; Published: 2008-06-19; RoHS: Y; MountType: SMT; PackageReference: 1206; Tolerance_%: 10%; Value2: 10V; CompType: Capacitor; LatestRevisionDate: 2017-03-09; PartNumber: GCM31CR71A226KE02; ComponentLink1Description: Datasheet link; Technology: Ceramic; ComponentLink1URL: http://psearch.en.murata.com/capacitor/product/GCM31CR71A226KE02%23.pdf
C73 C77 C83 C85 C91 C93 C156 C160 = CMP-0079154-1: as C13 on sheet PROC054D_AWR_1_AWR_4_LC_Filtering; ComponentLink1Description: Datasheet link; Cap_F: 1µF; RoHS: Y; Tolerance_%: 10%; Supplier 1: Digi-Key; PackageReference: 0603; Technology: Ceramic; PartNumber: GCM188R71C105KA64J; TempCo: X7R; Supplier Part Number 2: 81-GCM188R71C105KA4J; Supplier 2: Mouser; AEC Grade: 1; Value2: 16V; ComponentLink1URL: https://www.murata.com/~/media/webrenewal/support/library/catalog/products/capacitor/mlcc/c03e.ashx; CompType: Capacitor; MountType: SMT; Supplier Part Number 1: 490-12657-1-ND
L17-L24 = CMP-0083745-1: as L1 on sheet PROC054D_AWR_1_AWR_4_LC_Filtering; ComponentLink1URL: https://product.tdk.com/info/en/catalog/datasheets/inductor_automotive_decoupling_nlcv32-efrd_en.pdf; RoHS: Y; Value1: 0.024 ohm; Material: Ferrite; MountType: SMT; PackageReference: 3.2x2.2x2.5mm; Value2: 2.85A; CompType: Inductor; Ind_H: 100nH; PartNumber: NLCV32T-R10M-EFRD; ComponentLink1Description: Datasheet link; Technology: Wirewound

## Sheet PROC054D_System_LED.SchDoc: SYSTEM_LED
size 558 x 431 mm; Date: Not shown in title block; ApprovedBy: Not shown in title block; CheckedBy: Not shown in title block; Author: Not shown in title block; CompanyName: Not shown in title block; DrawnBy: a0271760; Engineer: Not shown in title block; Organization: Not shown in title block; Address1: Not shown in title block; Address2: Not shown in title block; Address3: Not shown in title block; Address4: Not shown in title block; DocumentNumber: 17; Revision: Use project pAWRameter SCH_Rev; SheetNumber: 17; SheetTotal: 19; PageSetup: Record=PageOptions|CenterHorizontal=True|CenterVertical=True|PrintScale=1.00|XCorrection=1.00|YCorrection=1.00|PrintKind=0|BorderSize=5000000|LeftOffset=0|BottomOffset=0|Orientation=2|PaperLength=1000|PaperWidth=1000|Scale=100|PaperSource=15|PrintQuality=600|MediaType=1|DitherType=10|PaperKind=Letter|PrintScaleMode=1; CurrentTime: Not shown in title block; CurrentDate: Not shown in title block; Time: Not shown in title block; DocumentFullPathAndName: Not shown in title block; DocumentName: Not shown in title block; ModifiedDate: Not shown in title block; ImagePath: Not shown in title block
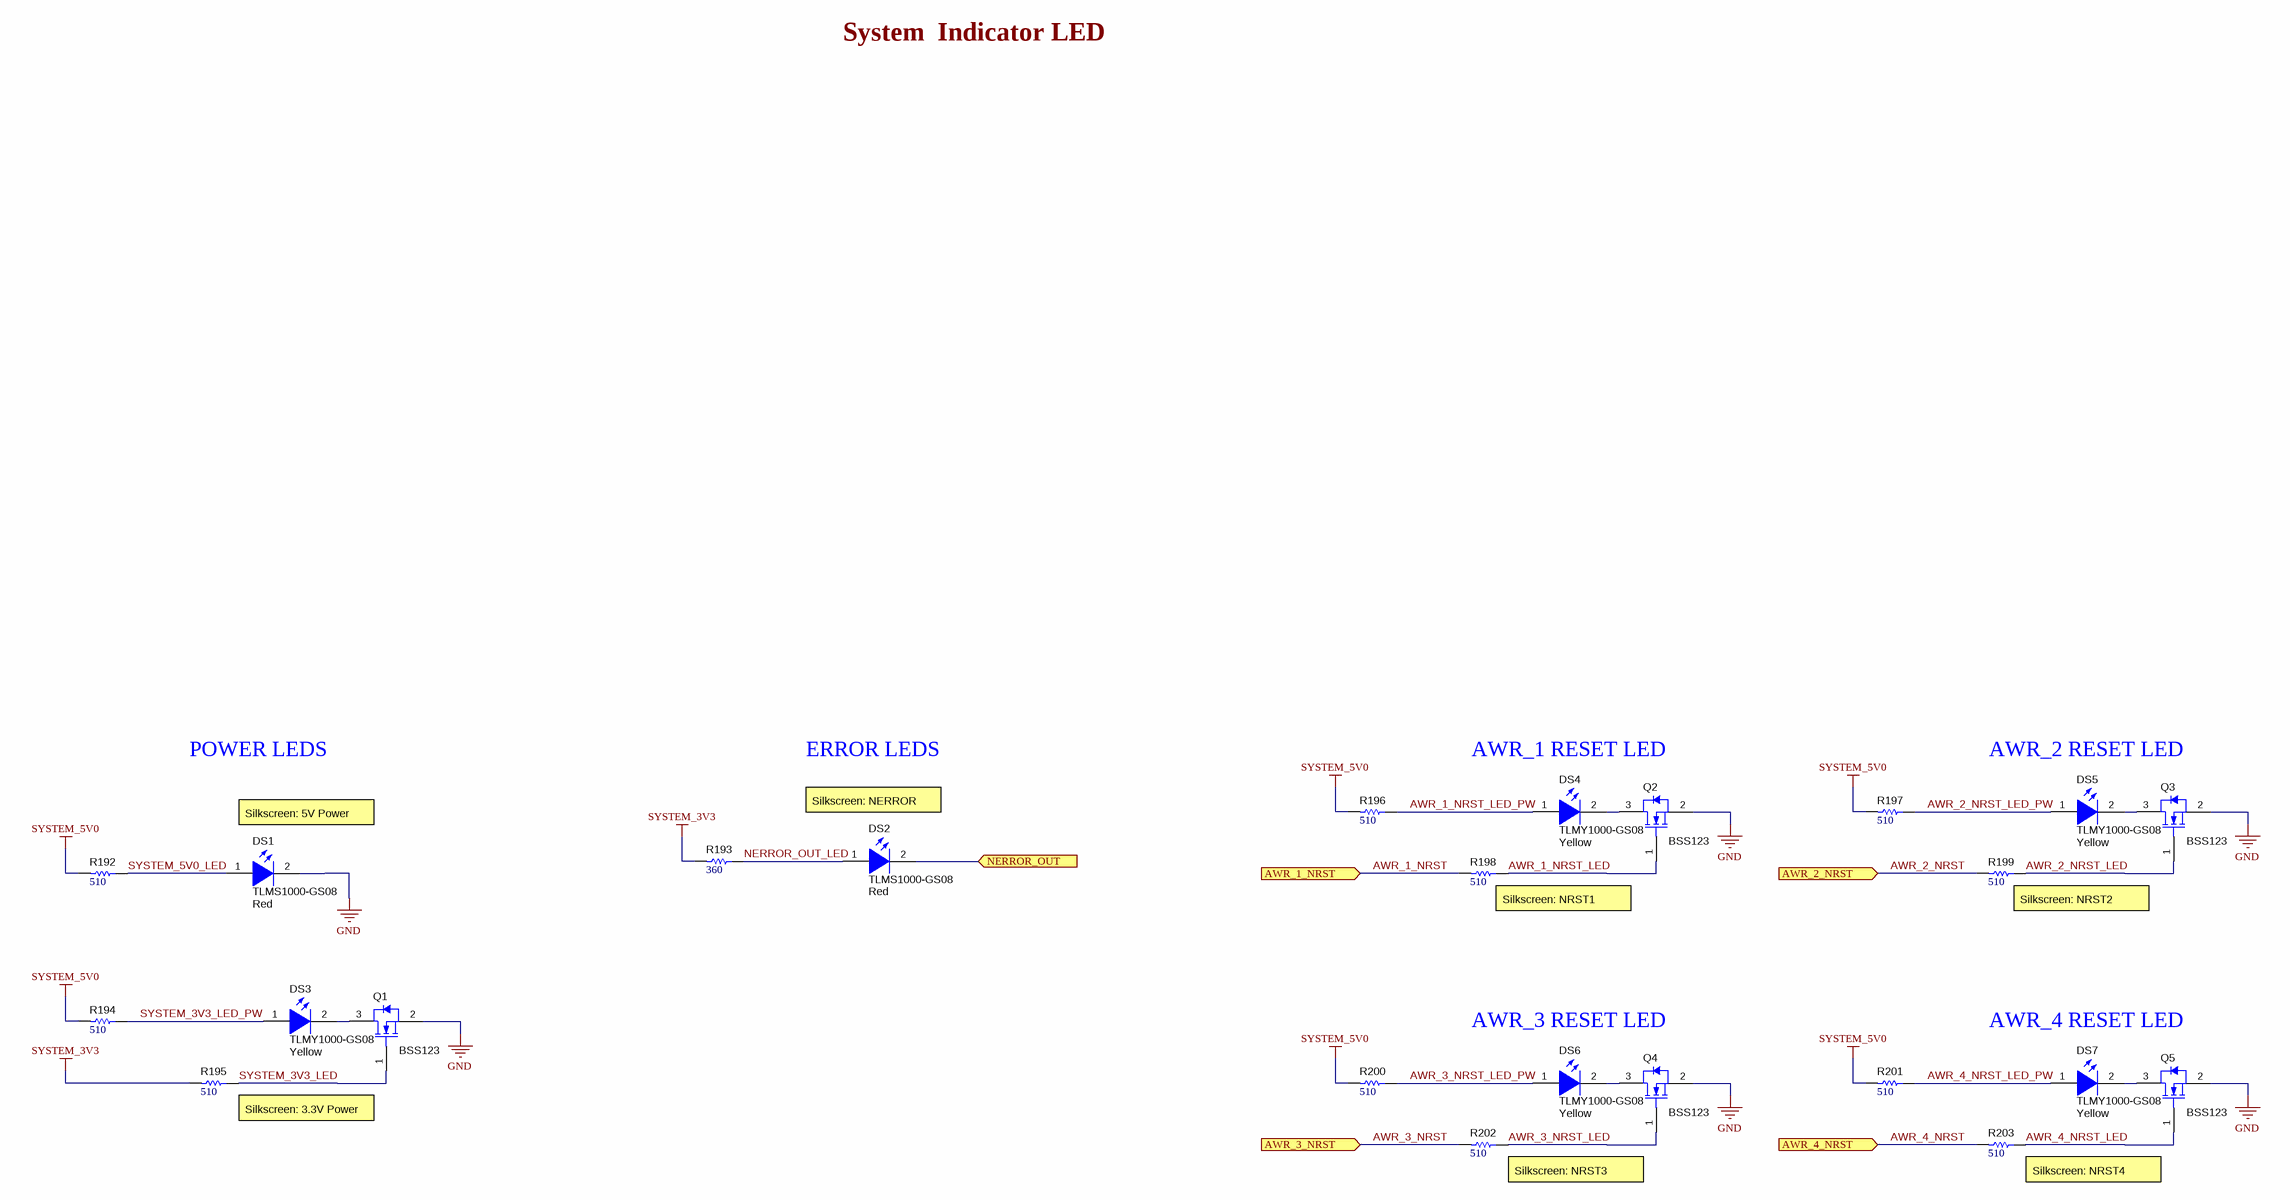
[diagram p35: PROC054D_System_LED.SchDoc]

### Parts
DS1  TLMS1000-GS08  value Red  [TLMx1000_Red]
DS2  TLMS1000-GS08  value Red  [TLMx1000_Red]
DS3  TLMY1000-GS08  value Yellow  [TLMx1000_Yellow]
DS4  TLMY1000-GS08  value Yellow  [TLMx1000_Yellow]
DS5  TLMY1000-GS08  value Yellow  [TLMx1000_Yellow]
DS6  TLMY1000-GS08  value Yellow  [TLMx1000_Yellow]
DS7  TLMY1000-GS08  value Yellow  [TLMx1000_Yellow]
Q1  BSS123  [SOT-23]
Q2  BSS123  [SOT-23]
Q3  BSS123  [SOT-23]
Q4  BSS123  [SOT-23]
Q5  BSS123  [SOT-23]
R192  ValueDisplayed: 510  [0402]  (hidden comment: ERJ-2GEJ511X)
R193  ValueDisplayed: 360  [0402]  (hidden comment: ERJ-2GEJ361X)
R194  ValueDisplayed: 510  [0402]  (hidden comment: ERJ-2GEJ511X)
R195  ValueDisplayed: 510  [0402]  (hidden comment: ERJ-2GEJ511X)
R196  ValueDisplayed: 510  [0402]  (hidden comment: ERJ-2GEJ511X)
R197  ValueDisplayed: 510  [0402]  (hidden comment: ERJ-2GEJ511X)
R198  ValueDisplayed: 510  [0402]  (hidden comment: ERJ-2GEJ511X)
R199  ValueDisplayed: 510  [0402]  (hidden comment: ERJ-2GEJ511X)
R200  ValueDisplayed: 510  [0402]  (hidden comment: ERJ-2GEJ511X)
R201  ValueDisplayed: 510  [0402]  (hidden comment: ERJ-2GEJ511X)
R202  ValueDisplayed: 510  [0402]  (hidden comment: ERJ-2GEJ511X)
R203  ValueDisplayed: 510  [0402]  (hidden comment: ERJ-2GEJ511X)

### Ports
AWR_1_NRST (in), AWR_2_NRST (in), AWR_3_NRST (in), AWR_4_NRST (in), NERROR_OUT (in)

### Nets
GND: DS1.2(K) Q1.2(S) Q2.2(S) Q3.2(S) Q4.2(S) Q5.2(S)
SYSTEM_3V3: R193.2 R195.2
SYSTEM_5V0: R192.2 R194.2 R196.2 R197.2 R200.2 R201.2
AWR_1_NRST: R198.2 ; port AWR_1_NRST
AWR_1_NRST_LED: Q2.1(G) R198.1
AWR_1_NRST_LED_PW: DS4.1(A) R196.1
AWR_2_NRST: R199.2 ; port AWR_2_NRST
AWR_2_NRST_LED: Q3.1(G) R199.1
AWR_2_NRST_LED_PW: DS5.1(A) R197.1
AWR_3_NRST: R202.2 ; port AWR_3_NRST
AWR_3_NRST_LED: Q4.1(G) R202.1
AWR_3_NRST_LED_PW: DS6.1(A) R200.1
AWR_4_NRST: R203.2 ; port AWR_4_NRST
AWR_4_NRST_LED: Q5.1(G) R203.1
AWR_4_NRST_LED_PW: DS7.1(A) R201.1
NERROR_OUT: DS2.2(K) ; port NERROR_OUT
NERROR_OUT_LED: DS2.1(A) R193.1
SYSTEM_3V3_LED: Q1.1(G) R195.1
SYSTEM_3V3_LED_PW: DS3.1(A) R194.1
SYSTEM_5V0_LED: DS1.1(A) R192.1
NetDS3_2: DS3.2(K) Q1.3(D)
NetDS4_2: DS4.2(K) Q2.3(D)
NetDS5_2: DS5.2(K) Q3.3(D)
NetDS6_2: DS6.2(K) Q4.3(D)
NetDS7_2: DS7.2(K) Q5.3(D)

### Notes on the sheet
- System  Indicator LED
- POWER LEDS
- ERROR LEDS
- AWR_1 RESET LED
- AWR_2 RESET LED
- Silkscreen: 5V Power
- Silkscreen: NERROR
- (near R198) Silkscreen: NRST1
- (near R199) Silkscreen: NRST2
- AWR_3 RESET LED
- AWR_4 RESET LED
- (near R195) Silkscreen: 3.3V Power
- (near R202) Silkscreen: NRST3
- (near R203) Silkscreen: NRST4
- Drawn By:
- SVN Rev:
- Number:
- TID #:
- Orderable:
- Rev:
- Sheet Title:
- File:
- Project Title:
- Designed for:
- Assembly VAWRiant:
- Mod. Date:
- Sheet:
- Size:
- of
- C
- http://www.ti.com
- Texas Instruments and/or its licensors do not wAWRrant the accuracy or completeness of this specification or any information contained therein. Texas Instruments and/or its licensors do not wAWRrant that this design will meet the specifications, will be suitable for your application or fit for any pAWRticulAWR purpose, or will operate in an implementation. Texas Instruments and/or its licensors do not wAWRrant that the design is production worthy. You should completely validate and test your design implementation to confirm the system functionality for your application.
- Engineer:
- Contact:
- © Texas Instruments

### Library data of the parts
DS1 DS2 = CMP-0078197-1: LED, Red, SMD; Manufacturer: Vishay-Semiconductor; Tjmax_C: 120°C; SizeAreaWB_mm2: 4.68; Vr_V: 6V; Power_TotalModule: 40mW; Angle: 160; SizeArea_mm2: 1.28; Ir_A: 10µA; SizeZ_mm: 0.65; Io_A: 2mA; Vf_V: 1.8V; SizeY_mm: 0.8; U/M: EA; Value1: .04W; SizeX_mm: 1.6; Type: AlInGaP; ComponentLink1Description: Datasheet link; RoHS: Y; Supplier Part Number 3: 78-TLMS1000; Supplier 1: Digi-Key; PackageReference: 1.6x0.8mm; Color: Red; PartNumber: TLMS1000-GS08; Publisher: Texas Instruments; Supplier Part Number 2: 35M3052; Supplier 2: Newark; Published: 2008-07-11; Value2: 1.8V; ComponentLink1URL: http://www.vishay.com/docs/83172/tlmo1000.pdf; LatestRevisionDate: 2017-10-12; CompType: LED; MountType: SMT; Supplier Part Number 1: TLMS1000-GS08CT-ND; Supplier 3: Mouser
DS3-DS7 = CMP-0078196-1: LED, Yellow, SMD; Manufacturer: Vishay-Semiconductor; Tjmax_C: 120°C; SizeAreaWB_mm2: 4.68; Vr_V: 6V; Power_TotalModule: 40mW; Angle: 160; SizeArea_mm2: 1.28; Ir_A: 10µA; SizeZ_mm: 0.65; Io_A: 2mA; Vf_V: 1.8V; SizeY_mm: 0.8; U/M: EA; Value1: .04W; SizeX_mm: 1.6; Type: AlInGaP; ComponentLink1Description: Datasheet link; RoHS: Y; Supplier Part Number 3: 78-TLMY1000; Supplier 1: Digi-Key; PackageReference: 1.6x0.8mm; Color: yellow; PartNumber: TLMY1000-GS08; Publisher: Texas Instruments; Supplier Part Number 2: 78Y9599; Supplier 2: Newark; Published: 2008-07-11; Value2: 1.8V; ComponentLink1URL: http://www.vishay.com/docs/83172/tlmo1000.pdf; LatestRevisionDate: 2017-10-12; CompType: LED; MountType: SMT; Supplier Part Number 1: TLMY1000-GS08CT-ND; Supplier 3: Mouser
Q1-Q5 = CMP-0000947-2: MOSFET, N-CH, 100 V, 0.17 A, SOT-23; Alternate Manufacturer: None; Manufacturer: Fairchild Semiconductor; SizeZ_mm: 1.1; ChType: N; Value2: 1.8 nC; Value1: 1; VdsMax_V: 100V; SizeX_mm: 2.5; SizeY_mm: 3; Vgs_V: 20V; Value: 100V; Rdson45_ohm: 10; SizeArea_mm2: 7.5; AEC Category: Q101; IdsMax_A: 1.7dA; SizeAreaWB_mm2: 14; U/M: EA; QgTyp_nC: 1.8; Supplier 2: Newark; Supplier 3: Mouser; Supplier 1: Digi-Key; Supplier Part Number 1: BSS123NCT-ND; Supplier Part Number 2: 58K8768; PartNumber: BSS123; ComponentLink1Description: Datasheet link; LatestRevisionDate: 2017-03-09; CompType: MOSFET; PackageReference: SOT-23; LatestRevisionNote: Added parts.; Publisher: Texas Instruments; AEC Qualified: ?; Published: 2008-06-19; Supplier Part Number 3: 512-BSS123; RoHS: Y; MountType: SMT; ComponentLink1URL: http://www.fairchildsemi.com/ds/BS/BSS123.pdf
R192 R194-R203 = CMP-0078212-1: RES, 510, 5%, 0.1 W, AEC-Q200 Grade 0, 0402; Manufacturer: Panasonic; Value_Code: 510R; SizeArea_mm2: 0.5; AEC Qualified: Y; AEC Category: Q200; Value: 510; SizeZ_mm: 0.6; EIA_Code: E24; TempCo: 200 ppm/C; AEC Grade: 0; Power_W: 100mW; VDC_V: 50V; Value2: 0.1W; U/M: EA; SizeX_mm: 1; ComponentLink1Description: Datasheet link; RoHS: Y; Supplier Part Number 3: 667-ERJ-2GEJ511X; Tolerance_%: 5%; Supplier 1: Digi-Key; PackageReference: 0402; Technology: Thick Film; Res_ohm: 510; PartNumber: ERJ-2GEJ511X; Supplier Part Number 2: 65T8293; Supplier 2: Newark; SizeY_mm: 0.5; ComponentLink1URL: https://industrial.panasonic.com/cdbs/www-data/pdf/RDA0000/DMA0000COL9.pdf; Value1: 5%; CompType: Resistor; MountType: SMT; Supplier Part Number 1: P510JCT-ND; Supplier 3: Mouser
R193 = CMP-0078194-1: RES, 360, 5%, 0.1 W, AEC-Q200 Grade 0, 0402; Manufacturer: Panasonic; Value_Code: 360R; SizeArea_mm2: 0.5; AEC Qualified: Y; AEC Category: Q200; Value: 360; SizeZ_mm: 0.6; EIA_Code: E24; TempCo: 200 ppm/C; AEC Grade: 0; Power_W: 100mW; VDC_V: 50V; Value2: 0.1W; U/M: EA; SizeX_mm: 1; ComponentLink1Description: Datasheet link; RoHS: Y; Supplier Part Number 3: 667-ERJ-2GEJ361X; Tolerance_%: 5%; Supplier 1: Digi-Key; PackageReference: 0402; Technology: Thick Film; Res_ohm: 360; PartNumber: ERJ-2GEJ361X; Supplier Part Number 2: 53W4165; Supplier 2: Newark; SizeY_mm: 0.5; ComponentLink1URL: https://industrial.panasonic.com/cdbs/www-data/pdf/RDA0000/DMA0000COL9.pdf; Value1: 5%; CompType: Resistor; MountType: SMT; Supplier Part Number 1: P360JCT-ND; Supplier 3: Mouser

## Sheet PROC054D_AWR_Pull_Resistors.SchDoc: PULL_UP_DOWN_1
size 558 x 431 mm; Date: Not shown in title block; ApprovedBy: Not shown in title block; CheckedBy: Not shown in title block; Author: Not shown in title block; CompanyName: Not shown in title block; DrawnBy: a0271760; Engineer: Not shown in title block; Organization: Not shown in title block; Address1: Not shown in title block; Address2: Not shown in title block; Address3: Not shown in title block; Address4: Not shown in title block; DocumentNumber: 12; Revision: Use project pAWRameter SCH_Rev; SheetNumber: 12; SheetTotal: 19; PageSetup: Record=PageOptions|CenterHorizontal=True|CenterVertical=True|PrintScale=1.00|XCorrection=1.00|YCorrection=1.00|PrintKind=0|BorderSize=5000000|LeftOffset=0|BottomOffset=0|Orientation=2|PaperLength=1000|PaperWidth=1000|Scale=100|PaperSource=15|PrintQuality=600|MediaType=1|DitherType=10|PaperKind=Letter|PrintScaleMode=1; CurrentTime: Not shown in title block; CurrentDate: Not shown in title block; Time: Not shown in title block; DocumentFullPathAndName: Not shown in title block; DocumentName: Not shown in title block; ModifiedDate: Not shown in title block; ImagePath: Not shown in title block
Used 4 times, as channels CASCADE_RF_BOARD/AWR_1, CASCADE_RF_BOARD/AWR_2, CASCADE_RF_BOARD/AWR_3, CASCADE_RF_BOARD/AWR_4. Parts and nets are listed once, with the designators drawn on the sheet.
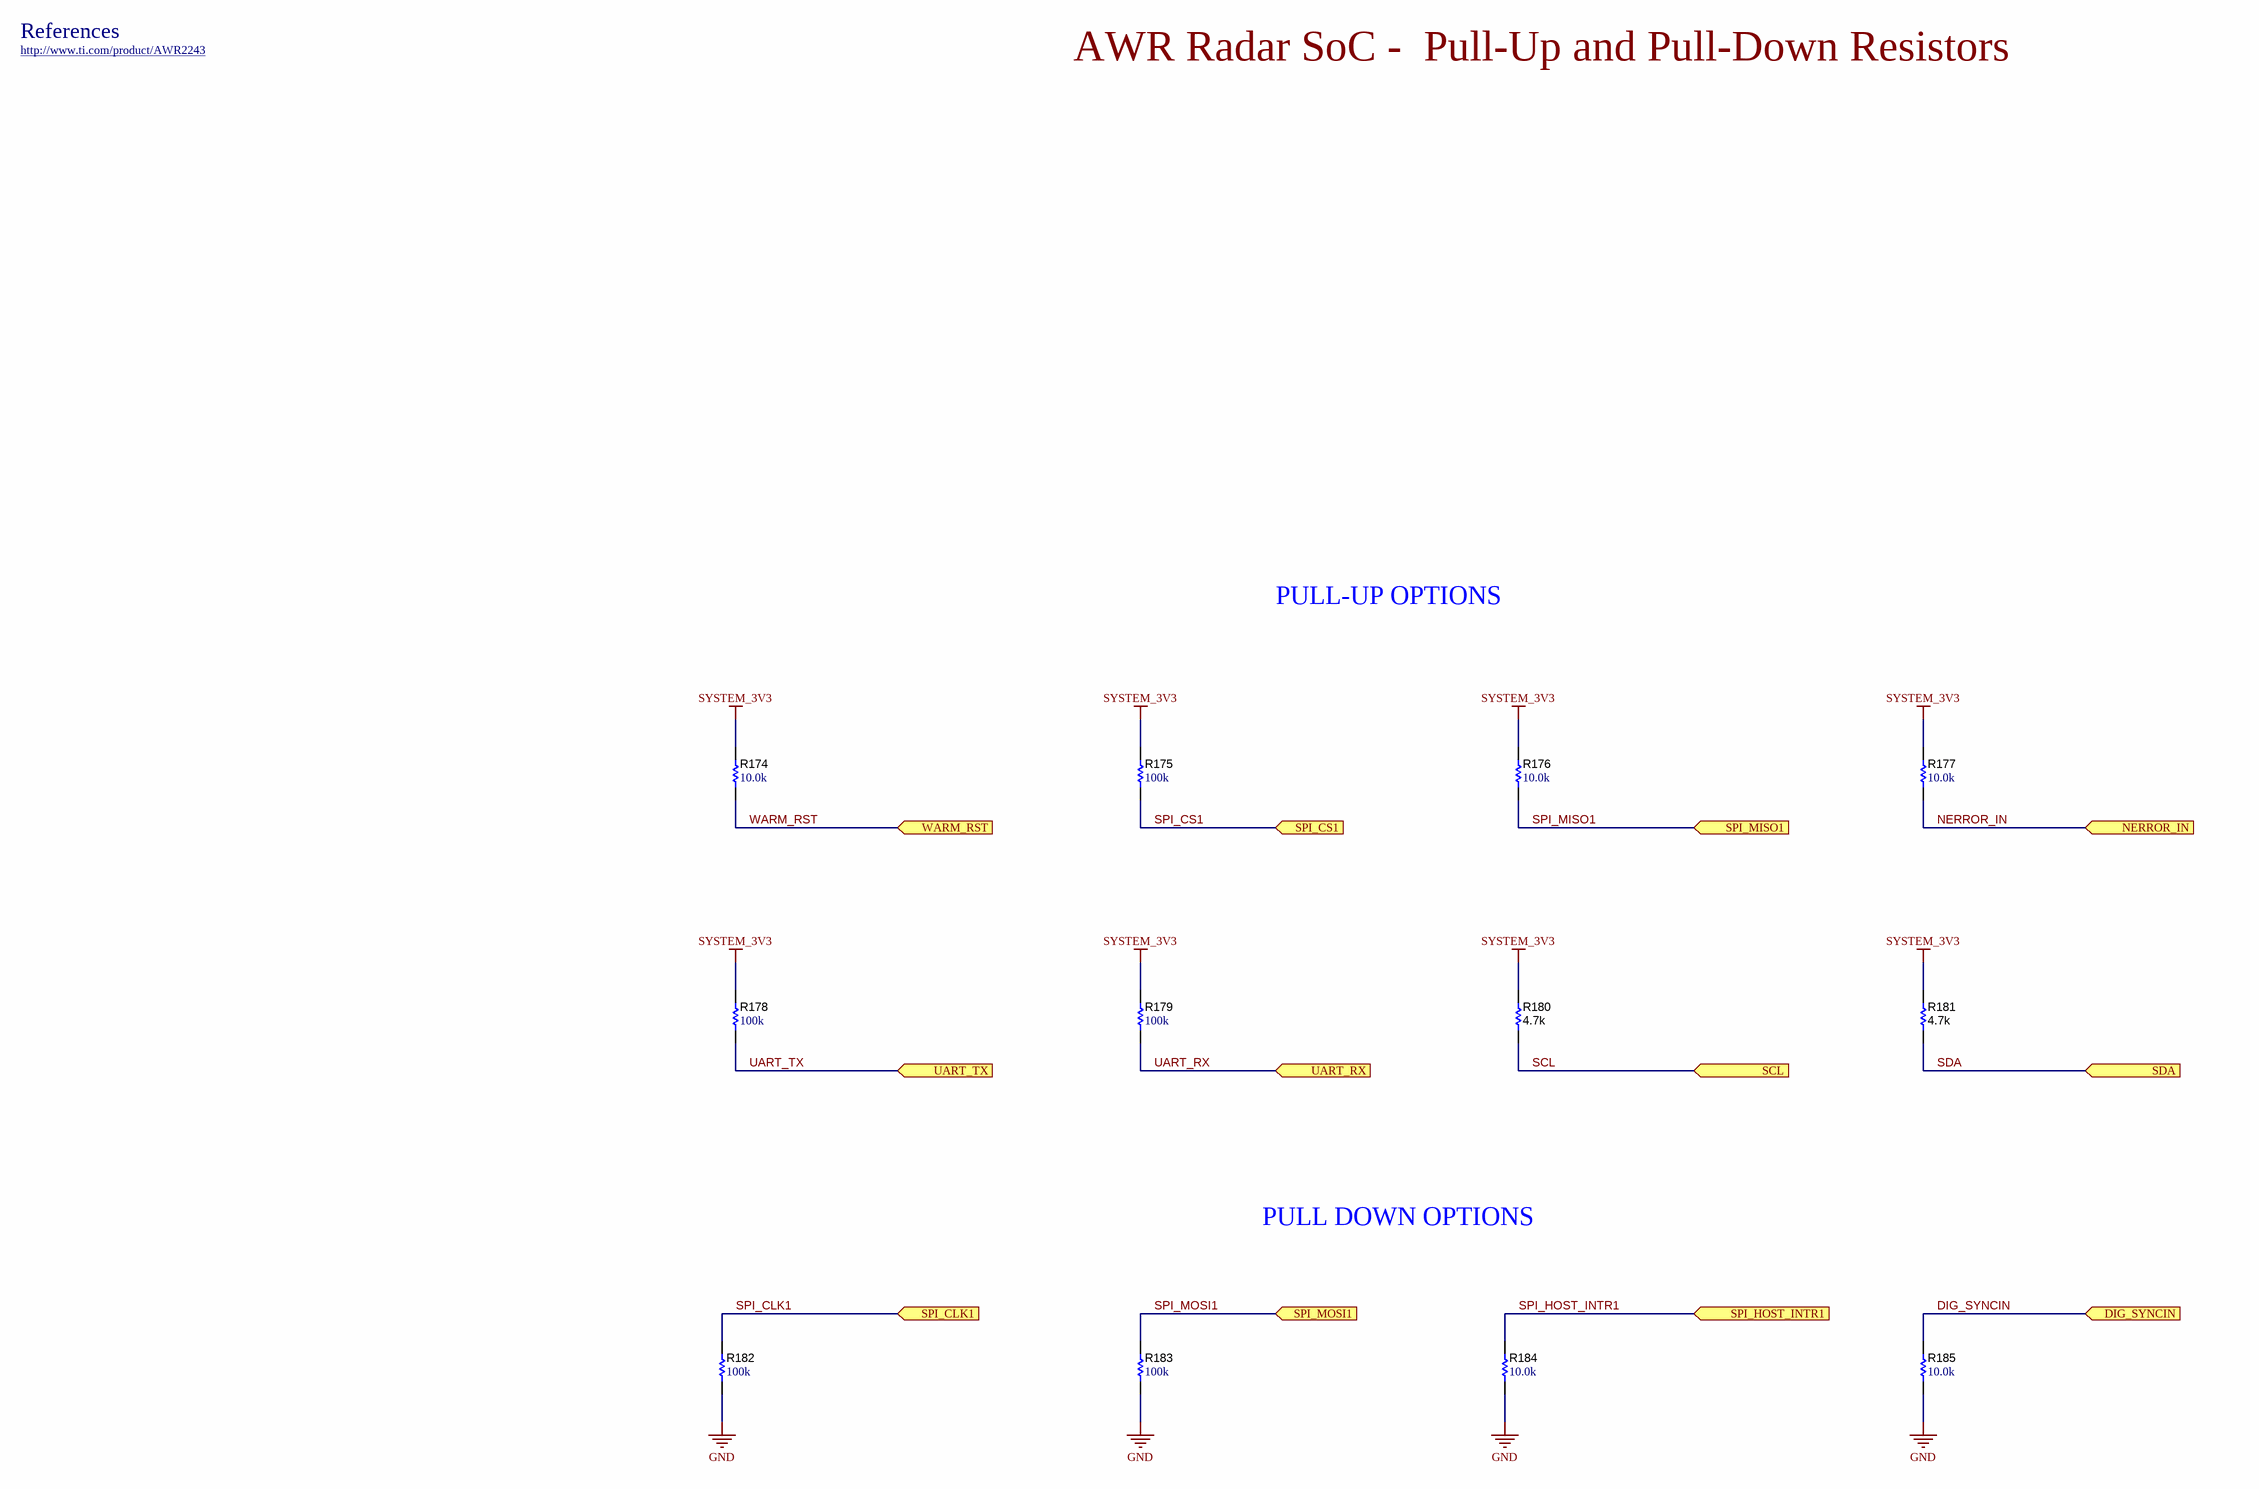
[diagram p36: PROC054D_AWR_Pull_Resistors.SchDoc]

### Parts
R174  ValueDisplayed: 10.0k  [0402]  (hidden comment: CRCW040210K0FKED)
R175  ValueDisplayed: 100k  [0402]  (hidden comment: CRCW0402100KFKED)
R176  ValueDisplayed: 10.0k  [0402]  (hidden comment: CRCW040210K0FKED)
R177  ValueDisplayed: 10.0k  [0402S]  (hidden comment: CRCW040210K0FKED)
R178  ValueDisplayed: 100k  [0402]  (hidden comment: CRCW0402100KFKED)
R179  ValueDisplayed: 100k  [0402]  (hidden comment: CRCW0402100KFKED)
R180  ValueDisplayed: 4.7k  [0402S]  (hidden comment: CRCW04024K70JNED)
R181  ValueDisplayed: 4.7k  [0402S]  (hidden comment: CRCW04024K70JNED)
R182  ValueDisplayed: 100k  [0402]  (hidden comment: CRCW0402100KFKED)
R183  ValueDisplayed: 100k  [0402]  (hidden comment: CRCW0402100KFKED)
R184  ValueDisplayed: 10.0k  [0402]  (hidden comment: CRCW040210K0FKED)
R185  ValueDisplayed: 10.0k  [0402S]  (hidden comment: CRCW040210K0FKED)

### Ports
DIG_SYNCIN (in), NERROR_IN (in), SCL (in), SDA (in), SPI_CLK1 (in), SPI_CS1 (in), SPI_HOST_INTR1 (in), SPI_MISO1 (in), SPI_MOSI1 (in), UART_RX (in), UART_TX (in), WARM_RST (in)

### Nets
GND: R182.1 R183.1 R184.1 R185.1
SYSTEM_3V3: R174.2 R175.2 R176.2 R177.2 R178.2 R179.2 R180.2 R181.2
DIG_SYNCIN: R185.2 ; port DIG_SYNCIN
NERROR_IN: R177.1 ; port NERROR_IN
SCL: R180.1 ; port SCL
SDA: R181.1 ; port SDA
SPI_CLK1: R182.2 ; port SPI_CLK1
SPI_CS1: R175.1 ; port SPI_CS1
SPI_HOST_INTR1: R184.2 ; port SPI_HOST_INTR1
SPI_MISO1: R176.1 ; port SPI_MISO1
SPI_MOSI1: R183.2 ; port SPI_MOSI1
UART_RX: R179.1 ; port UART_RX
UART_TX: R178.1 ; port UART_TX
WARM_RST: R174.1 ; port WARM_RST

### Channels
CASCADE_RF_BOARD/AWR_1: designators end in _1; ports DIG_SYNCIN=DIG_SYNCIN NERROR_IN=NERROR_IN SCL=SCL SDA=SDA SPI_CLK1=SPI_CLK1 SPI_CS1=SPI_CS1 SPI_HOST_INTR1=SPI_HOST_INTR1 SPI_MISO1=SPI_MISO1 SPI_MOSI1=SPI_MOSI1 UART_RX=UART_RX UART_TX=UART_TX WARM_RST=WARM_RST
CASCADE_RF_BOARD/AWR_2: designators end in _2; ports DIG_SYNCIN=DIG_SYNCIN NERROR_IN=NERROR_IN SCL=SCL SDA=SDA SPI_CLK1=SPI_CLK1 SPI_CS1=SPI_CS1 SPI_HOST_INTR1=SPI_HOST_INTR1 SPI_MISO1=SPI_MISO1 SPI_MOSI1=SPI_MOSI1 UART_RX=UART_RX UART_TX=UART_TX WARM_RST=WARM_RST
CASCADE_RF_BOARD/AWR_3: designators end in _3; ports DIG_SYNCIN=DIG_SYNCIN NERROR_IN=NERROR_IN SCL=SCL SDA=SDA SPI_CLK1=SPI_CLK1 SPI_CS1=SPI_CS1 SPI_HOST_INTR1=SPI_HOST_INTR1 SPI_MISO1=SPI_MISO1 SPI_MOSI1=SPI_MOSI1 UART_RX=UART_RX UART_TX=UART_TX WARM_RST=WARM_RST
CASCADE_RF_BOARD/AWR_4: designators end in _4; ports DIG_SYNCIN=DIG_SYNCIN NERROR_IN=NERROR_IN SCL=SCL SDA=SDA SPI_CLK1=SPI_CLK1 SPI_CS1=SPI_CS1 SPI_HOST_INTR1=SPI_HOST_INTR1 SPI_MISO1=SPI_MISO1 SPI_MOSI1=SPI_MOSI1 UART_RX=UART_RX UART_TX=UART_TX WARM_RST=WARM_RST

### Notes on the sheet
- References
- http://www.ti.com/product/AWR2243
- AWR Radar SoC -  Pull-Up and Pull-Down Resistors
- PULL-UP OPTIONS
- PULL DOWN OPTIONS
- Drawn By:
- SVN Rev:
- Number:
- TID #:
- Orderable:
- Rev:
- Sheet Title:
- File:
- Project Title:
- Designed for:
- Assembly VAWRiant:
- Mod. Date:
- Sheet:
- Size:
- of
- C
- http://www.ti.com
- Texas Instruments and/or its licensors do not wAWRrant the accuracy or completeness of this specification or any information contained therein. Texas Instruments and/or its licensors do not wAWRrant that this design will meet the specifications, will be suitable for your application or fit for any pAWRticulAWR purpose, or will operate in an implementation. Texas Instruments and/or its licensors do not wAWRrant that the design is production worthy. You should completely validate and test your design implementation to confirm the system functionality for your application.
- Engineer:
- Contact:
- © Texas Instruments

### Library data of the parts
R174 R176 R177 R184 R185 = CMP-0025958-3: RES, 10.0 k, 1%, 0.063 W, AEC-Q200 Grade 0, 0402; Manufacturer: Vishay-Dale; Power_W: 63mW; TempCo: 100 ppm/C; Value_Code: 10k0; Value: 10.0k; EIA_Code: E96; Res_ohm: 10k; SizeX_mm: 1; SizeY_mm: 0.5; SizeZ_mm: 0.6; Value2: 0.063W; AEC Qualified: Y; VDC_V: 50V; AEC Category: Q200; AEC Grade: 0; Supplier Part Number 2: 52K6595; Supplier 2: Newark; Supplier Part Number 3: 71-CRCW0402-10K-E3; Supplier 3: Mouser; RoHS: E; Value1: 1%; MountType: SMT; Supplier 1: Digi-Key; PackageReference: 0402; Tolerance_%: 1%; SizeArea_mm2: 0.5; CompType: Resistor; PartNumber: CRCW040210K0FKED; ComponentLink1Description: Datasheet link; Supplier Part Number 1: 541-10.0KLCT-ND; Technology: Thick Film; ComponentLink1URL: http://www.vishay.com/docs/20035/dcrcwe3.pdf
R175 R178 R179 R182 R183 = CMP-0025950-3: RES, 100 k, 1%, 0.063 W, AEC-Q200 Grade 0, 0402; Manufacturer: Vishay-Dale; Power_W: 63mW; TempCo: 100 ppm/C; Value: 100k; EIA_Code: E96; SizeX_mm: 1; SizeY_mm: 0.5; SizeZ_mm: 0.6; Value2: 0.063W; AEC Qualified: Y; VDC_V: 50V; AEC Category: Q200; AEC Grade: 0; Supplier Part Number 2: 52K6607; Supplier 2: Newark; Supplier Part Number 3: 71-CRCW0402-100K-E3; Supplier 3: Mouser; Value_Code: 100k; RoHS: E; Value1: 1%; MountType: SMT; Supplier 1: Digi-Key; PackageReference: 0402; Tolerance_%: 1%; Res_ohm: 100k; SizeArea_mm2: 0.5; CompType: Resistor; PartNumber: CRCW0402100KFKED; ComponentLink1Description: Datasheet link; Supplier Part Number 1: 541-100KLCT-ND; Technology: Thick Film; ComponentLink1URL: http://www.vishay.com/docs/20035/dcrcwe3.pdf
R180 R181 = CMP-0026938-5: RES, 4.7 k, 5%, 0.063 W, AEC-Q200 Grade 0, 0402; Manufacturer: Vishay-Dale; Power_W: 63mW; TempCo: 200 ppm/C; Value_Code: 4k70; Value: 4.7k; EIA_Code: E24; SizeX_mm: 1; SizeY_mm: 0.5; SizeZ_mm: 0.6; Value2: 0.063W; AEC Qualified: Y; VDC_V: 50V; AEC Category: Q200; AEC Grade: 0; Supplier Part Number 2: 59M6733; Supplier 2: Newark; Supplier Part Number 3: 71-CRCW0402J-4.7K-E3; Supplier 3: Mouser; RoHS: E; Value1: 5%; MountType: SMT; Supplier 1: Digi-Key; PackageReference: 0402; Tolerance_%: 5%; Res_ohm: 4.7k; SizeArea_mm2: 0.5; CompType: Resistor; PartNumber: CRCW04024K70JNED; ComponentLink1Description: Datasheet link; Supplier Part Number 1: 541-4.7KJCT-ND; Technology: Thick Film; ComponentLink1URL: http://www.vishay.com/docs/20035/dcrcwe3.pdf